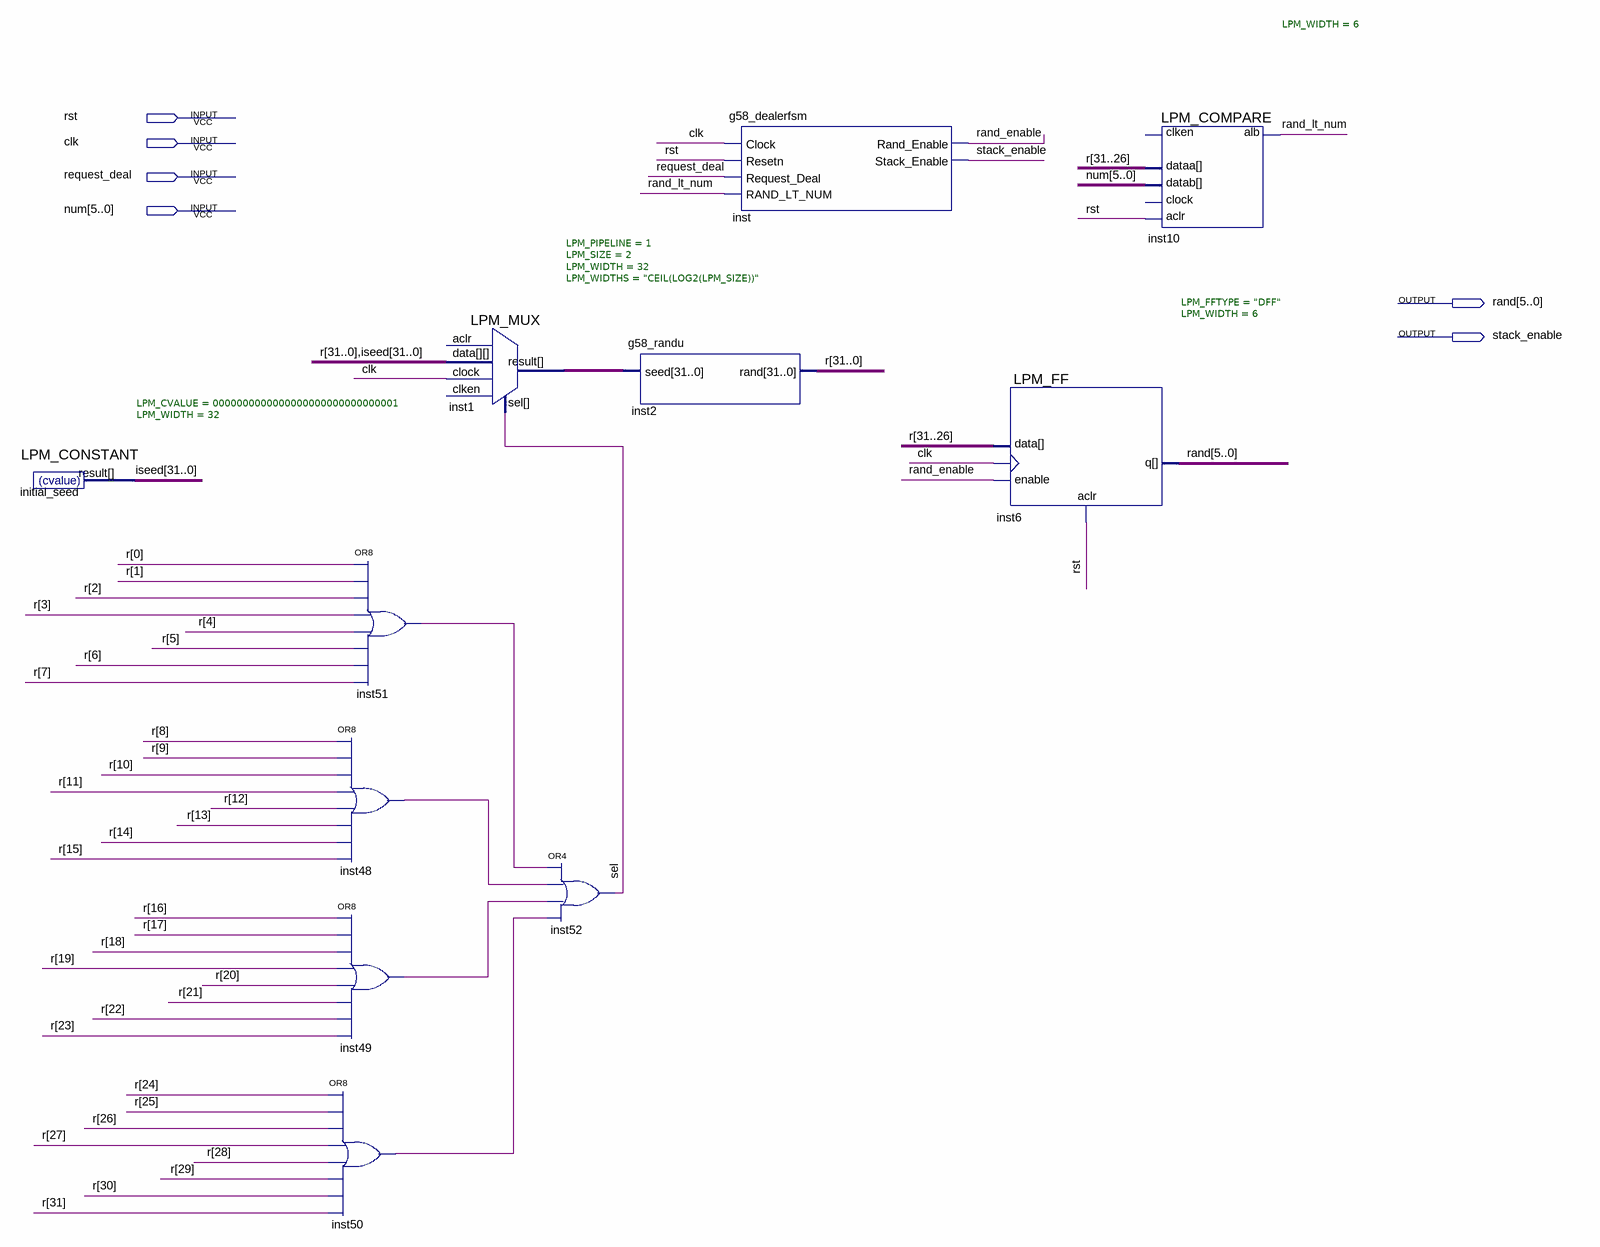
[diagram p0: schematic sheet]
// Quartus schematic g58_dealer_rng.bdf as structural Verilog: 11 symbols, 6 pins
module g58_dealer_rng (
  input  rst,
  input  clk,
  input  request_deal,
  input  [5:0] num,
  output [5:0] \rand ,
  output stack_enable
);

  wire inst48_out, inst49_out, inst50_out, inst51_out, rand_enable, rand_lt_num, sel;
  wire [31:0] inst1_result, iseed, r;

  LPM_CONSTANT #(.LPM_CVALUE(0000000000000000000000000000001), .LPM_WIDTH(32)) initial_seed (.result(iseed));
  or inst51 (inst51_out, r[0], r[1], r[2], r[3], r[4], r[5], r[6], r[7]);
  or inst48 (inst48_out, r[8], r[9], r[10], r[11], r[12], r[13], r[14], r[15]);
  or inst49 (inst49_out, r[16], r[17], r[18], r[19], r[20], r[21], r[22], r[23]);
  or inst50 (inst50_out, r[24], r[25], r[26], r[27], r[28], r[29], r[30], r[31]);
  LPM_MUX #(.LPM_PIPELINE(1), .LPM_SIZE(2), .LPM_WIDTH(32), .LPM_WIDTHS("CEIL(LOG2(LPM_SIZE))")) inst1 (
    .data({r, iseed}), .clock(clk), .sel(sel), .result(inst1_result));  // open: aclr, clken
  or inst52 (sel, inst51_out, inst48_out, inst49_out, inst50_out);
  g58_randu inst2 (.seed(inst1_result), .\rand (r));
  g58_dealerfsm inst (
    .Clock(clk), .Resetn(rst), .Request_Deal(request_deal), .RAND_LT_NUM(rand_lt_num),
    .Rand_Enable(rand_enable), .Stack_Enable(stack_enable));
  LPM_FF #(.LPM_FFTYPE("DFF"), .LPM_WIDTH(6)) inst6 (
    .aclr(rst), .clock(clk), .data(r[31:26]), .enable(rand_enable), .q(\rand ));
  LPM_COMPARE #(.LPM_WIDTH(6)) inst10 (
    .aclr(rst), .dataa(r[31:26]), .datab(num), .alb(rand_lt_num));  // open: clken, clock
endmodule
